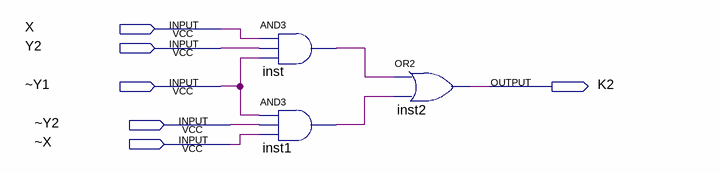
[diagram p0: schematic sheet]
// Quartus schematic K2.bdf as structural Verilog: 3 symbols, 6 pins
module K2 (
  input  X,
  input  Y2,
  input  \~Y1 ,
  input  \~Y2 ,
  input  \~X ,
  output K2
);

  wire inst1_out, inst_out;

  and inst (inst_out, X, Y2, \~Y1 );
  and inst1 (inst1_out, \~Y1 , \~Y2 , \~X );
  or inst2 (K2, inst_out, inst1_out);
endmodule
